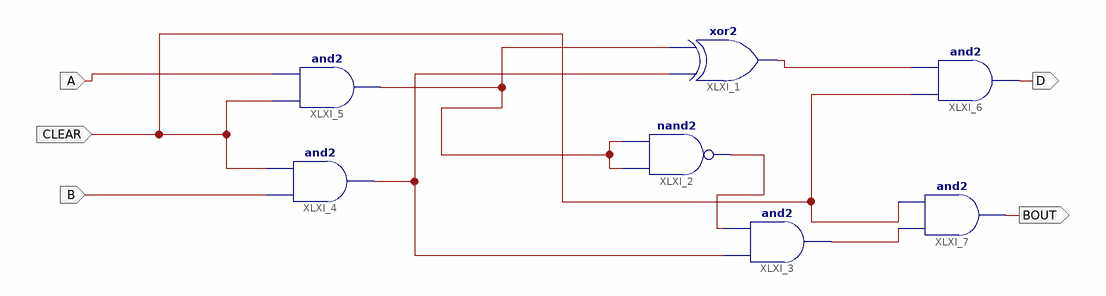
[diagram p0: schematic sheet 1]
// Xilinx ISE schematic halfsubtracter.sch (artix7) as structural Verilog: 7 symbols, 5 ports
module halfsubtracter (
  input  A,
  input  B,
  input  CLEAR,
  output D,
  output BOUT
);

  wire XLXN_2, XLXN_19;

  xor XLXI_1 (D, B, A);
  nand XLXI_2 (XLXN_2, A, A);
  and XLXI_3 (XLXN_19, B, XLXN_2);
  and XLXI_4 (B, B, CLEAR);
  and XLXI_5 (A, CLEAR, A);
  and XLXI_6 (D, CLEAR, D);
  and XLXI_7 (BOUT, XLXN_19, CLEAR);
endmodule
